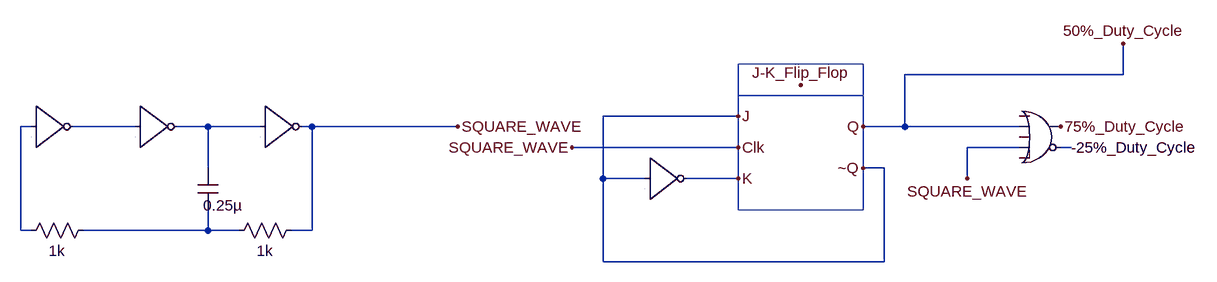
[diagram p0: schematic PWM_generating.asc]
PWM_generating.asc, the LTspice schematic file:
Version 4
SHEET 1 1880 976
WIRE 1744 96 1744 48
WIRE 1744 96 1408 96
WIRE 1152 160 944 160
WIRE 64 176 48 176
WIRE 224 176 128 176
WIRE 336 176 288 176
WIRE 416 176 336 176
WIRE 496 176 480 176
WIRE 720 176 496 176
WIRE 1408 176 1408 96
WIRE 1408 176 1344 176
WIRE 1584 176 1408 176
WIRE 1152 208 896 208
WIRE 1584 208 1504 208
WIRE 1664 208 1648 208
WIRE 336 240 336 176
WIRE 1376 240 1344 240
WIRE 944 256 944 160
WIRE 1008 256 944 256
WIRE 1152 256 1072 256
WIRE 1504 256 1504 208
WIRE 48 336 48 176
WIRE 64 336 48 336
WIRE 336 336 336 304
WIRE 336 336 144 336
WIRE 384 336 336 336
WIRE 496 336 496 176
WIRE 496 336 464 336
WIRE 944 384 944 256
WIRE 1376 384 1376 240
WIRE 1376 384 944 384
FLAG 720 176 SQUARE_WAVE
FLAG 1648 176 75%_Duty_Cycle
FLAG 1744 48 50%_Duty_Cycle
FLAG 1248 112 J-K_Flip_Flop
FLAG 1152 160 J
FLAG 1152 256 K
FLAG 1152 208 Clk
FLAG 1344 176 Q
FLAG 1344 240 ~Q
FLAG 896 208 SQUARE_WAVE
FLAG 1504 256 SQUARE_WAVE
SYMBOL Digital\\inv 64 112 R0
WINDOW 0 8 32 Invisible 2
SYMATTR InstName A1
SYMBOL Digital\\inv 224 112 R0
WINDOW 0 8 32 Invisible 2
SYMATTR InstName A2
SYMBOL Digital\\inv 416 112 R0
WINDOW 0 8 32 Invisible 2
SYMATTR InstName A3
SYMBOL cap 320 240 R0
WINDOW 0 24 8 Invisible 2
WINDOW 3 39 42 Top 2
SYMATTR InstName C1
SYMATTR Value 0.25µ
SYMBOL res 160 320 R90
WINDOW 0 0 56 Invisible 2
WINDOW 3 32 56 VTop 2
SYMATTR InstName R1
SYMATTR Value 1k
SYMBOL res 480 320 R90
WINDOW 0 0 56 Invisible 2
WINDOW 3 32 56 VTop 2
SYMATTR InstName R2
SYMATTR Value 1k
SYMBOL Digital\\or 1616 128 R0
WINDOW 0 -8 8 Invisible 2
SYMATTR InstName A5
SYMBOL Digital\\inv 1008 192 R0
WINDOW 0 8 32 Invisible 2
SYMATTR InstName A6
TEXT 1664 208 Left 2 !-25%_Duty_Cycle
RECTANGLE Normal 1344 128 1152 80
RECTANGLE Normal 1344 304 1152 128

The netlist it stands for:
* PWM_generating.asc
A1 N001 0 0 0 0 N002 0 0 BUF
A2 N002 0 0 0 0 N003 0 0 BUF
A3 N003 0 0 0 0 Clk 0 0 BUF
C1 N003 N005 0.25µ
R1 N005 N001 1k
R2 Clk N005 1k
A5 0 Q 0 Clk 0 N004 75%_Duty_Cycle 0 OR
A6 ~Q 0 0 0 0 K 0 0 BUF
-25%_Duty_Cycle
.backanno
.end